# EAGLE schematic untitled (EAGLE 6.1)

## Sheet 1 of 4
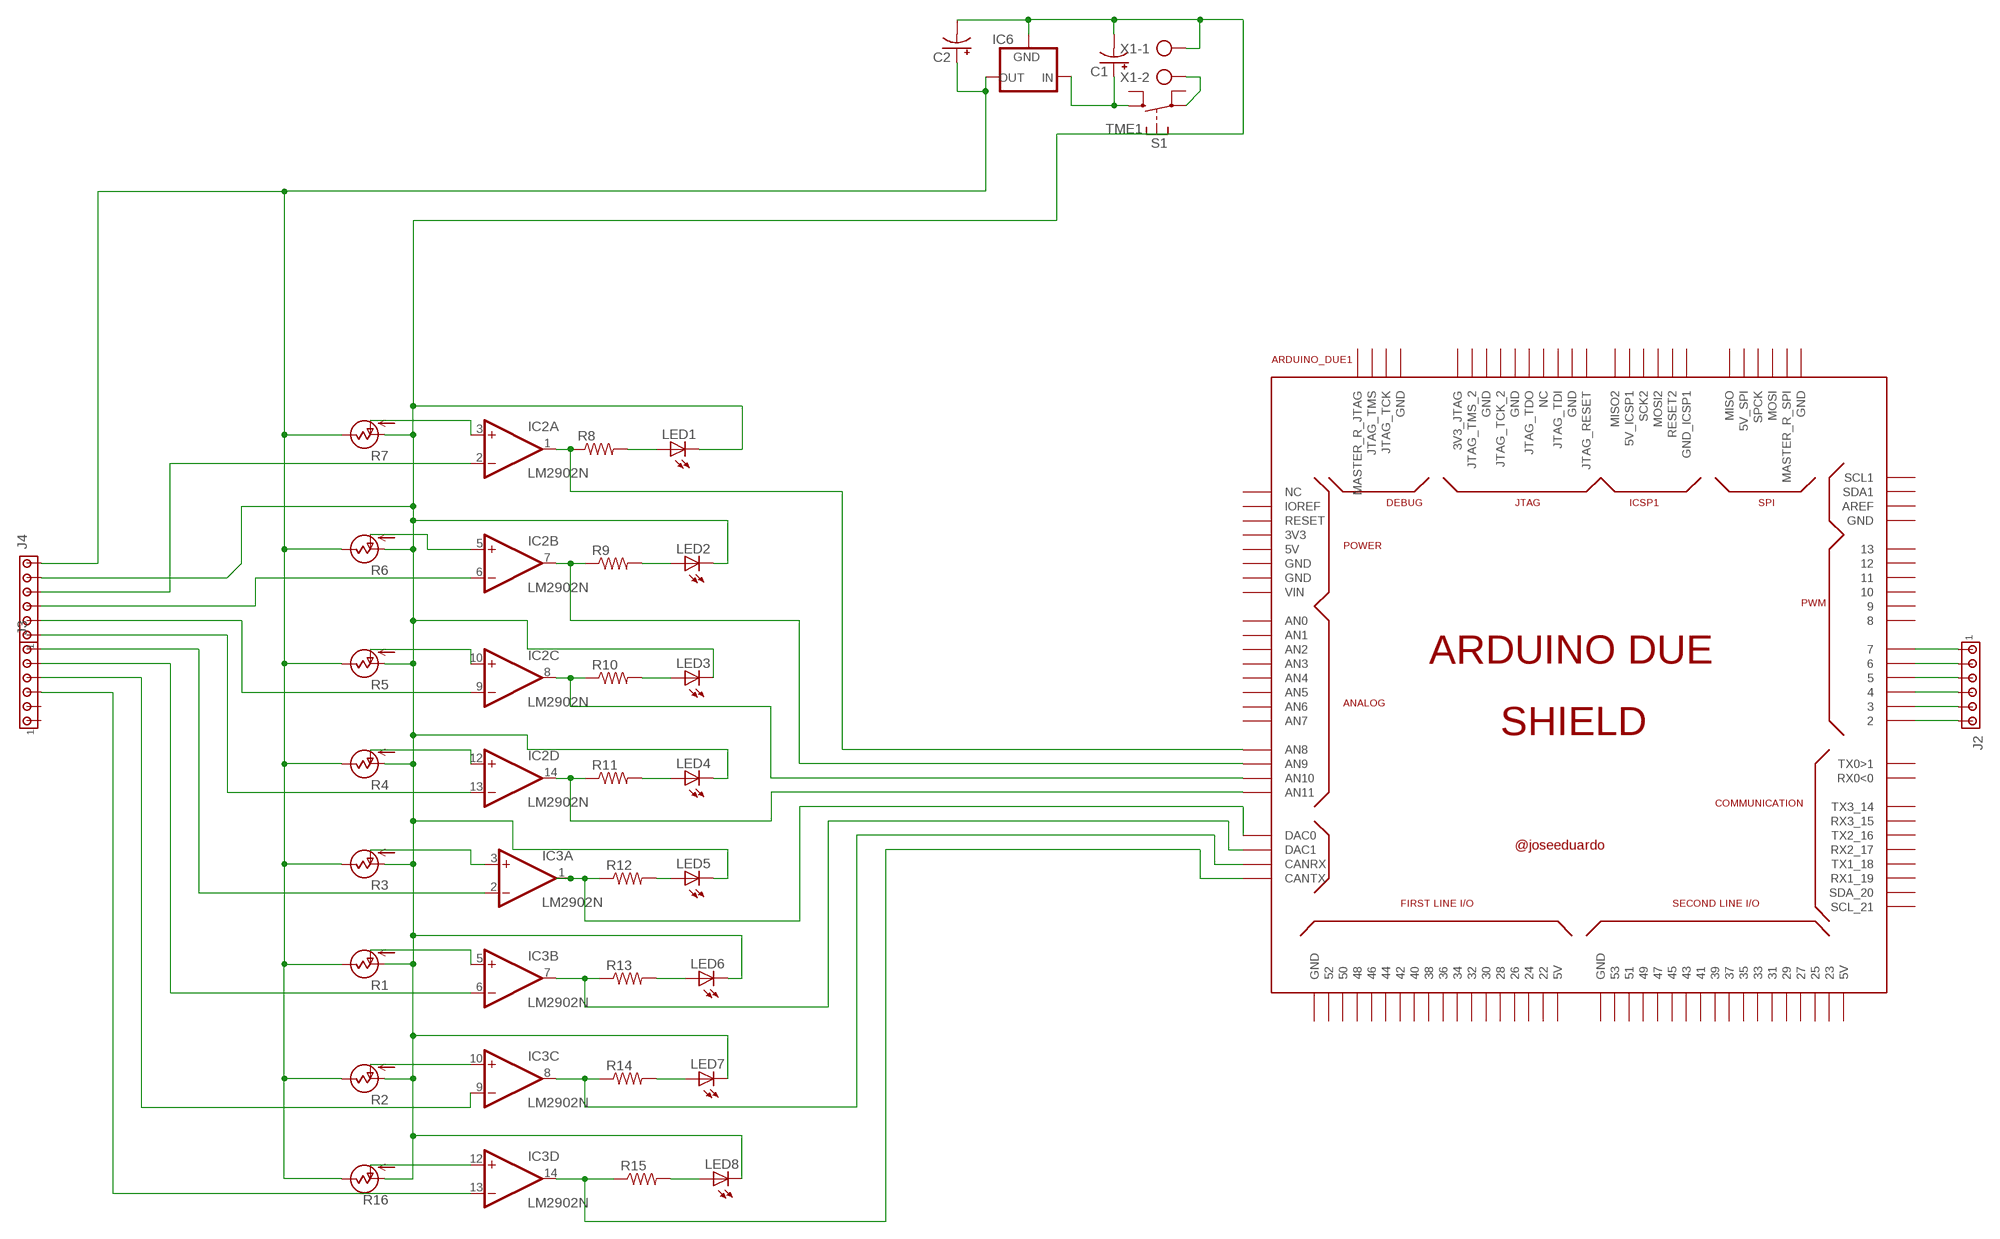
[diagram p0: schematic, sheet 1]

### Parts
ARDUINO_DUE1  ARDUINO_DUE_SHIELD  [ARDUINO_DUE_SHIELD]
C1  CPOL-USE5-10.5  [E5-10,5]
C2  CPOL-USE5-10.5  [E5-10,5]
IC2  LM2902N  [DIL14]
IC3  LM2902N  [DIL14]
IC6  V_REG_78XXSIDE  [78XXL]
J2  MTA06-156  [1X6MTA]
J3  MTA06-156  [1X6MTA]
J4  MTA06-156  [1X6MTA]
LED1  LED3MM  [LED3MM]
LED2  LED3MM  [LED3MM]
LED3  LED3MM  [LED3MM]
LED4  LED3MM  [LED3MM]
LED5  LED3MM  [LED3MM]
LED6  LED3MM  [LED3MM]
LED7  LED3MM  [LED3MM]
LED8  LED3MM  [LED3MM]
R1  POTTRS63P  [S63P]
R2  POTTRS63P  [S63P]
R3  POTTRS63P  [S63P]
R4  POTTRS63P  [S63P]
R5  POTTRS63P  [S63P]
R6  POTTRS63P  [S63P]
R7  POTTRS63P  [S63P]
R8  R-US_0207/10  [0207/10]
R9  R-US_0207/10  [0207/10]
R10  R-US_0207/10  [0207/10]
R11  R-US_0207/10  [0207/10]
R12  R-US_0207/10  [0207/10]
R13  R-US_0207/10  [0207/10]
R14  R-US_0207/10  [0207/10]
R15  R-US_0207/10  [0207/10]
R16  POTTRS63P  [S63P]
S1  TME1  [TME1]
X1  AK300/2  [AK300/2]

### Nets
N$1: ARDUINO_DUE1.7 J2.1
N$2: IC2.2(A:-IN) J4.4
N$3: ARDUINO_DUE1.6 J2.2
N$4: IC2.6(B:-IN) J4.3
N$5: IC2.5(B:+IN) R6.S(OUT)
N$6: IC2.3(A:+IN) R7.S(OUT)
N$7: IC2.10(C:+IN) R5.S(OUT)
N$8: IC2.12(D:+IN) R4.S(OUT)
N$9: IC3.3(A:+IN) R3.S(OUT)
N$10: IC3.5(B:+IN) R1.S(OUT)
N$11: IC3.10(C:+IN) R2.S(OUT)
N$12: IC3.12(D:+IN) R16.S(OUT)
N$13: ARDUINO_DUE1.A8(AN8) IC2.1(A:OUT) R8.1
N$14: LED1.A R8.2
N$15: ARDUINO_DUE1.A9(AN9) IC2.7(B:OUT) R9.1
N$16: LED2.A R9.2
N$17: ARDUINO_DUE1.A10(AN10) IC2.8(C:OUT) R10.1
N$18: LED3.A R10.2
N$19: ARDUINO_DUE1.A11(AN11) IC2.14(D:OUT) R11.1
N$20: ARDUINO_DUE1.DAC0 IC3.1(A:OUT) R12.1
N$21: ARDUINO_DUE1.DAC1 IC3.7(B:OUT) R13.1
N$22: ARDUINO_DUE1.CANRX IC3.8(C:OUT) R14.1
N$23: LED4.A R11.2
N$24: LED5.A R12.2
N$25: LED6.A R13.2
N$26: LED7.A R14.2
N$27: ARDUINO_DUE1.CANTX IC3.14(D:OUT) R15.1
N$28: LED8.A R15.2
N$29: IC2.9(C:-IN) J4.2
N$30: ARDUINO_DUE1.5 J2.3
N$31: IC2.13(D:-IN) J4.1
N$32: IC3.2(A:-IN) J3.6
N$33: IC3.6(B:-IN) J3.5
N$34: IC3.9(C:-IN) J3.4
N$35: ARDUINO_DUE1.4 J2.4
N$36: ARDUINO_DUE1.3 J2.5
N$37: ARDUINO_DUE1.2 J2.6
N$38: IC3.13(D:-IN) J3.3
N$39: S1.2(P) X1.2
N$41: C2.+ IC6.OUT J4.6 R1.E(VSS) R2.E(VSS) R3.E(VSS) R4.E(VSS) R5.E(VSS) R6.E(VSS) R7.E(VSS) R16.E(VSS)
N$55: C1.- C2.- IC6.GND J4.5 LED1.K(C) LED2.K(C) LED3.K(C) LED4.K(C) LED5.K(C) LED6.K(C) LED7.K(C) LED8.K(C) R1.A(VDD) R2.A(VDD) R3.A(VDD) R4.A(VDD) R5.A(VDD) R6.A(VDD) R7.A(VDD) R16.A(VDD) X1.1
N$63: C1.+ IC6.IN S1.1(S)
Unconnected: ARDUINO_DUE1.0(RX0<0) ARDUINO_DUE1.1(TX0>1) ARDUINO_DUE1.3V3 ARDUINO_DUE1.3V3_JTAG ARDUINO_DUE1.5V0(5V) ARDUINO_DUE1.5V0_1(5V) ARDUINO_DUE1.5V0_2(5V) ARDUINO_DUE1.5V_2(5V_SPI) ARDUINO_DUE1.5V_ICSP1 ARDUINO_DUE1.8 ARDUINO_DUE1.9 ARDUINO_DUE1.10 ARDUINO_DUE1.11 ARDUINO_DUE1.12 ARDUINO_DUE1.13 ARDUINO_DUE1.14(TX3_14) ARDUINO_DUE1.15(RX3_15) ARDUINO_DUE1.16(TX2_16) ARDUINO_DUE1.17(RX2_17) ARDUINO_DUE1.18(TX1_18) ARDUINO_DUE1.19(RX1_19) ARDUINO_DUE1.20(SDA_20) ARDUINO_DUE1.21(SCL_21) ARDUINO_DUE1.22 ARDUINO_DUE1.23 ARDUINO_DUE1.24 ARDUINO_DUE1.25 ARDUINO_DUE1.26 ARDUINO_DUE1.27 ARDUINO_DUE1.28 ARDUINO_DUE1.29 ARDUINO_DUE1.30 ARDUINO_DUE1.31 ARDUINO_DUE1.32 ARDUINO_DUE1.33 ARDUINO_DUE1.34 ARDUINO_DUE1.35 ARDUINO_DUE1.36 ARDUINO_DUE1.37 ARDUINO_DUE1.38 ARDUINO_DUE1.39 ARDUINO_DUE1.40 ARDUINO_DUE1.41 ARDUINO_DUE1.42 ARDUINO_DUE1.43 ARDUINO_DUE1.44 ARDUINO_DUE1.45 ARDUINO_DUE1.46 ARDUINO_DUE1.47 ARDUINO_DUE1.48 ARDUINO_DUE1.49 ARDUINO_DUE1.50 ARDUINO_DUE1.51 ARDUINO_DUE1.52 ARDUINO_DUE1.53 ARDUINO_DUE1.A0(AN0) ARDUINO_DUE1.A1(AN1) ARDUINO_DUE1.A2(AN2) ARDUINO_DUE1.A3(AN3) ARDUINO_DUE1.A4(AN4) ARDUINO_DUE1.A5(AN5) ARDUINO_DUE1.A6(AN6) ARDUINO_DUE1.A7(AN7) ARDUINO_DUE1.AREF ARDUINO_DUE1.GND ARDUINO_DUE1.GND_1(GND) ARDUINO_DUE1.GND_2(GND) ARDUINO_DUE1.GND_3(GND) ARDUINO_DUE1.GND_4(GND) ARDUINO_DUE1.GND_5(GND) ARDUINO_DUE1.GND_7(GND) ARDUINO_DUE1.GND_8(GND) ARDUINO_DUE1.GND_9(GND) ARDUINO_DUE1.GND_10(GND) ARDUINO_DUE1.GND_ICSP1 ARDUINO_DUE1.IOREF ARDUINO_DUE1.JTAG_RESET ARDUINO_DUE1.JTAG_TCK ARDUINO_DUE1.JTAG_TCK_2 ARDUINO_DUE1.JTAG_TDI ARDUINO_DUE1.JTAG_TDO ARDUINO_DUE1.JTAG_TMS ARDUINO_DUE1.JTAG_TMS_2 ARDUINO_DUE1.MASTER_RESET_JTAG(MASTER_R_JTAG) ARDUINO_DUE1.MASTER_RESET_SPI(MASTER_R_SPI) ARDUINO_DUE1.MISO ARDUINO_DUE1.MISO2 ARDUINO_DUE1.MOSI ARDUINO_DUE1.MOSI2 ARDUINO_DUE1.NC_2(NC) ARDUINO_DUE1.NC_5(NC) ARDUINO_DUE1.RESET ARDUINO_DUE1.RESET2 ARDUINO_DUE1.SCK2 ARDUINO_DUE1.SCL1 ARDUINO_DUE1.SDA1 ARDUINO_DUE1.SPCK ARDUINO_DUE1.VIN J3.1 J3.2 S1.4(P) S1.5(S)

## Sheet 2 of 4
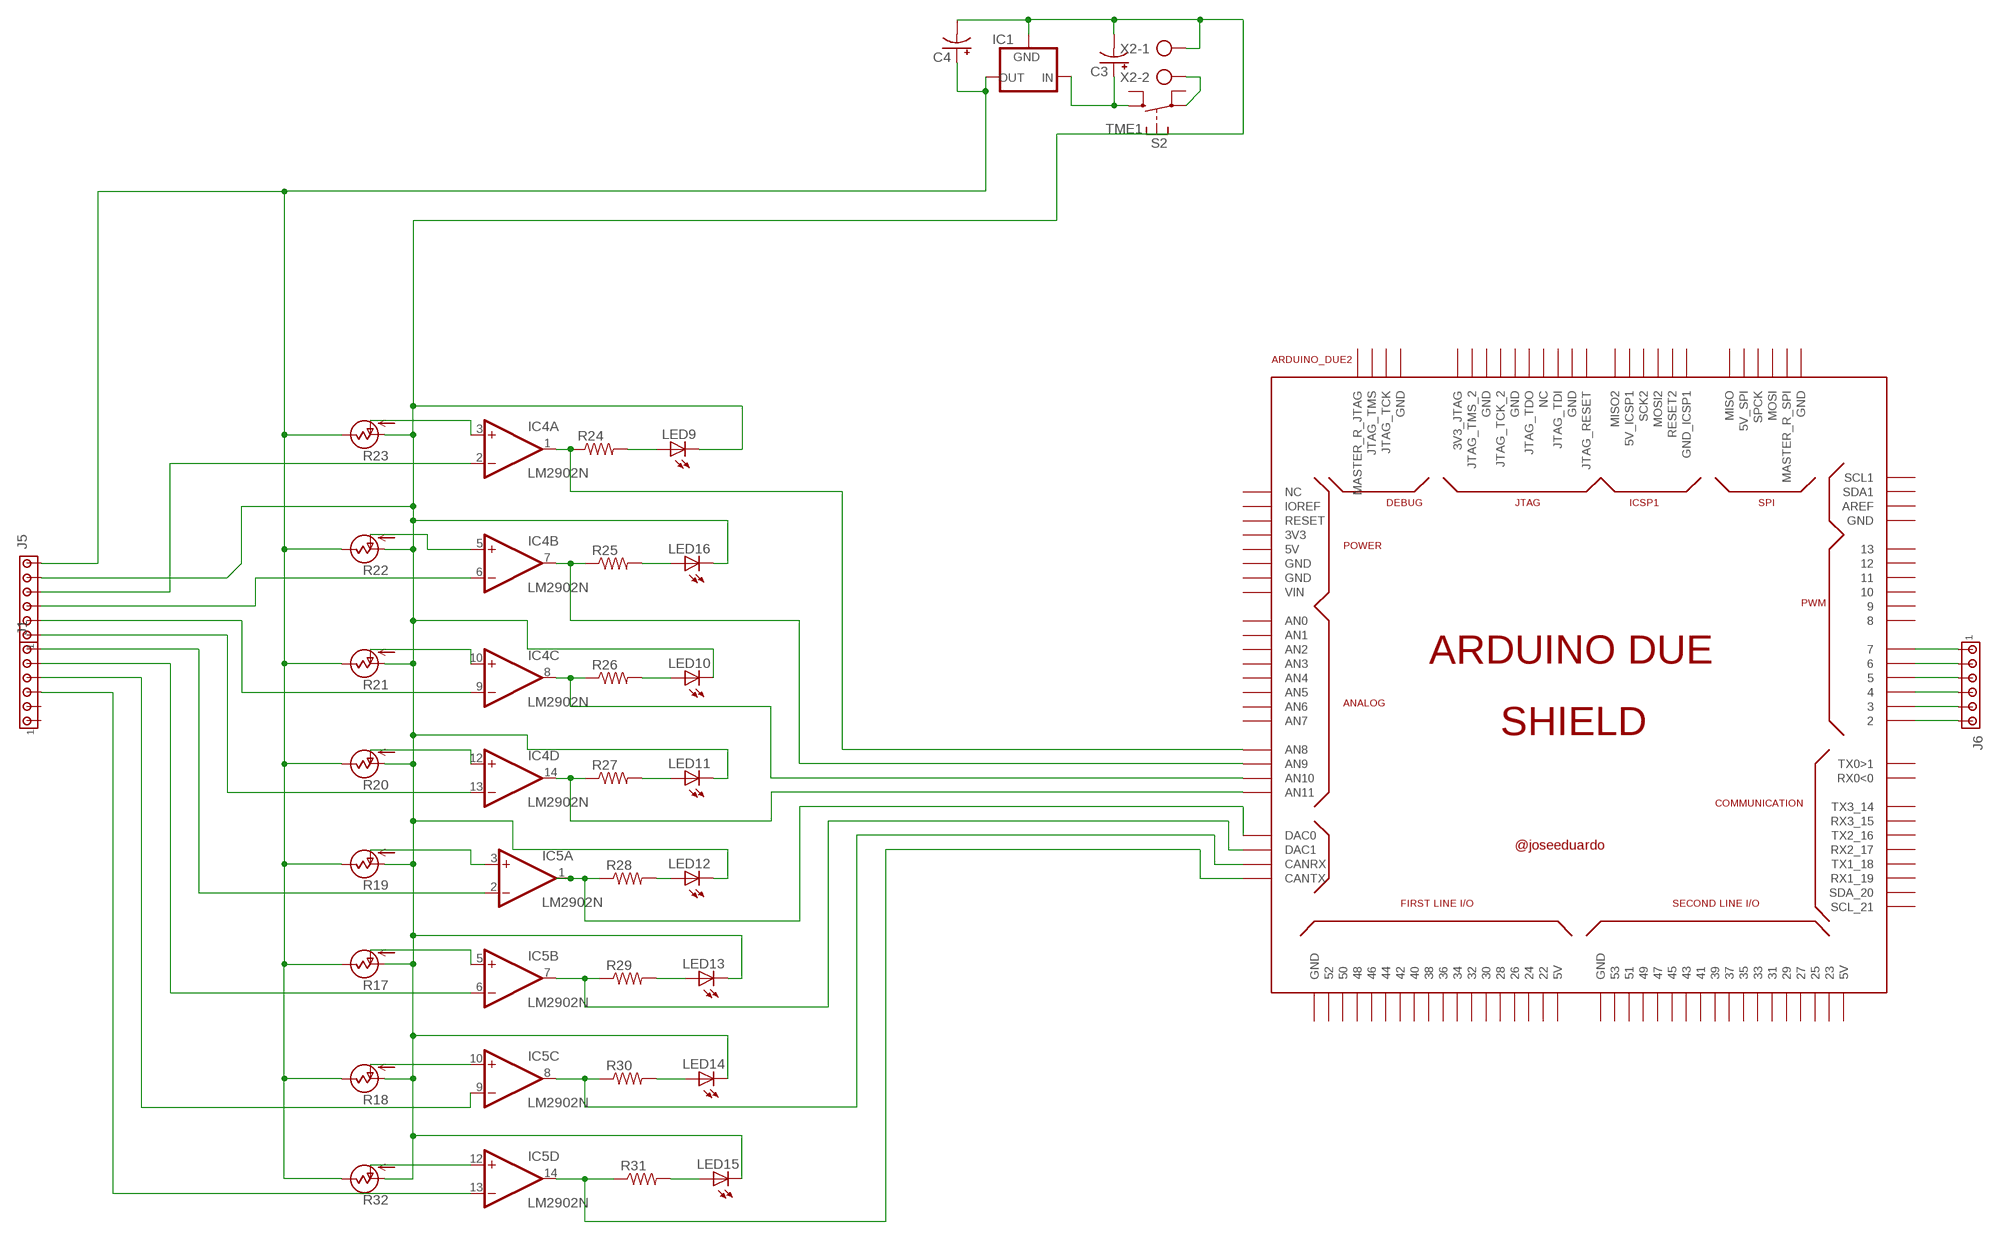
[diagram p1: schematic, sheet 2]

### Parts
ARDUINO_DUE2  ARDUINO_DUE_SHIELD  [ARDUINO_DUE_SHIELD]
C3  CPOL-USE5-10.5  [E5-10,5]
C4  CPOL-USE5-10.5  [E5-10,5]
IC1  V_REG_78XXSIDE  [78XXL]
IC4  LM2902N  [DIL14]
IC5  LM2902N  [DIL14]
J1  MTA06-156  [1X6MTA]
J5  MTA06-156  [1X6MTA]
J6  MTA06-156  [1X6MTA]
LED9  LED3MM  [LED3MM]
LED10  LED3MM  [LED3MM]
LED11  LED3MM  [LED3MM]
LED12  LED3MM  [LED3MM]
LED13  LED3MM  [LED3MM]
LED14  LED3MM  [LED3MM]
LED15  LED3MM  [LED3MM]
LED16  LED3MM  [LED3MM]
R17  POTTRS63P  [S63P]
R18  POTTRS63P  [S63P]
R19  POTTRS63P  [S63P]
R20  POTTRS63P  [S63P]
R21  POTTRS63P  [S63P]
R22  POTTRS63P  [S63P]
R23  POTTRS63P  [S63P]
R24  R-US_0207/10  [0207/10]
R25  R-US_0207/10  [0207/10]
R26  R-US_0207/10  [0207/10]
R27  R-US_0207/10  [0207/10]
R28  R-US_0207/10  [0207/10]
R29  R-US_0207/10  [0207/10]
R30  R-US_0207/10  [0207/10]
R31  R-US_0207/10  [0207/10]
R32  POTTRS63P  [S63P]
S2  TME1  [TME1]
X2  AK300/2  [AK300/2]

### Nets
N$60: IC4.5(B:+IN) R22.S(OUT)
N$61: IC4.3(A:+IN) R23.S(OUT)
N$62: IC4.10(C:+IN) R21.S(OUT)
N$64: IC4.12(D:+IN) R20.S(OUT)
N$65: IC5.3(A:+IN) R19.S(OUT)
N$66: IC5.5(B:+IN) R17.S(OUT)
N$67: IC5.10(C:+IN) R18.S(OUT)
N$68: IC5.12(D:+IN) R32.S(OUT)
N$69: ARDUINO_DUE2.A8(AN8) IC4.1(A:OUT) R24.1
N$70: ARDUINO_DUE2.A9(AN9) IC4.7(B:OUT) R25.1
N$71: ARDUINO_DUE2.A10(AN10) IC4.8(C:OUT) R26.1
N$72: LED10.A R26.2
N$73: ARDUINO_DUE2.A11(AN11) IC4.14(D:OUT) R27.1
N$74: ARDUINO_DUE2.DAC0 IC5.1(A:OUT) R28.1
N$75: ARDUINO_DUE2.DAC1 IC5.7(B:OUT) R29.1
N$76: ARDUINO_DUE2.CANRX IC5.8(C:OUT) R30.1
N$77: LED11.A R27.2
N$78: LED12.A R28.2
N$79: LED13.A R29.2
N$80: LED14.A R30.2
N$81: ARDUINO_DUE2.CANTX IC5.14(D:OUT) R31.1
N$82: LED15.A R31.2
N$83: LED9.A R24.2
N$84: LED16.A R25.2
N$85: IC4.2(A:-IN) J5.4
N$86: IC4.6(B:-IN) J5.3
N$87: IC4.9(C:-IN) J5.2
N$88: IC4.13(D:-IN) J5.1
N$89: IC5.2(A:-IN) J1.6
N$90: IC5.6(B:-IN) J1.5
N$91: IC5.9(C:-IN) J1.4
N$92: IC5.13(D:-IN) J1.3
N$93: C4.+ IC1.OUT J5.6 R17.E(VSS) R18.E(VSS) R19.E(VSS) R20.E(VSS) R21.E(VSS) R22.E(VSS) R23.E(VSS) R32.E(VSS)
N$94: C3.- C4.- IC1.GND J5.5 LED9.K(C) LED10.K(C) LED11.K(C) LED12.K(C) LED13.K(C) LED14.K(C) LED15.K(C) LED16.K(C) R17.A(VDD) R18.A(VDD) R19.A(VDD) R20.A(VDD) R21.A(VDD) R22.A(VDD) R23.A(VDD) R32.A(VDD) X2.1
N$95: C3.+ IC1.IN S2.1(S)
N$96: ARDUINO_DUE2.7 J6.1
N$97: ARDUINO_DUE2.6 J6.2
N$98: ARDUINO_DUE2.5 J6.3
N$99: ARDUINO_DUE2.4 J6.4
N$100: ARDUINO_DUE2.3 J6.5
N$101: ARDUINO_DUE2.2 J6.6
N$102: S2.2(P) X2.2
Unconnected: ARDUINO_DUE2.0(RX0<0) ARDUINO_DUE2.1(TX0>1) ARDUINO_DUE2.3V3 ARDUINO_DUE2.3V3_JTAG ARDUINO_DUE2.5V0(5V) ARDUINO_DUE2.5V0_1(5V) ARDUINO_DUE2.5V0_2(5V) ARDUINO_DUE2.5V_2(5V_SPI) ARDUINO_DUE2.5V_ICSP1 ARDUINO_DUE2.8 ARDUINO_DUE2.9 ARDUINO_DUE2.10 ARDUINO_DUE2.11 ARDUINO_DUE2.12 ARDUINO_DUE2.13 ARDUINO_DUE2.14(TX3_14) ARDUINO_DUE2.15(RX3_15) ARDUINO_DUE2.16(TX2_16) ARDUINO_DUE2.17(RX2_17) ARDUINO_DUE2.18(TX1_18) ARDUINO_DUE2.19(RX1_19) ARDUINO_DUE2.20(SDA_20) ARDUINO_DUE2.21(SCL_21) ARDUINO_DUE2.22 ARDUINO_DUE2.23 ARDUINO_DUE2.24 ARDUINO_DUE2.25 ARDUINO_DUE2.26 ARDUINO_DUE2.27 ARDUINO_DUE2.28 ARDUINO_DUE2.29 ARDUINO_DUE2.30 ARDUINO_DUE2.31 ARDUINO_DUE2.32 ARDUINO_DUE2.33 ARDUINO_DUE2.34 ARDUINO_DUE2.35 ARDUINO_DUE2.36 ARDUINO_DUE2.37 ARDUINO_DUE2.38 ARDUINO_DUE2.39 ARDUINO_DUE2.40 ARDUINO_DUE2.41 ARDUINO_DUE2.42 ARDUINO_DUE2.43 ARDUINO_DUE2.44 ARDUINO_DUE2.45 ARDUINO_DUE2.46 ARDUINO_DUE2.47 ARDUINO_DUE2.48 ARDUINO_DUE2.49 ARDUINO_DUE2.50 ARDUINO_DUE2.51 ARDUINO_DUE2.52 ARDUINO_DUE2.53 ARDUINO_DUE2.A0(AN0) ARDUINO_DUE2.A1(AN1) ARDUINO_DUE2.A2(AN2) ARDUINO_DUE2.A3(AN3) ARDUINO_DUE2.A4(AN4) ARDUINO_DUE2.A5(AN5) ARDUINO_DUE2.A6(AN6) ARDUINO_DUE2.A7(AN7) ARDUINO_DUE2.AREF ARDUINO_DUE2.GND ARDUINO_DUE2.GND_1(GND) ARDUINO_DUE2.GND_2(GND) ARDUINO_DUE2.GND_3(GND) ARDUINO_DUE2.GND_4(GND) ARDUINO_DUE2.GND_5(GND) ARDUINO_DUE2.GND_7(GND) ARDUINO_DUE2.GND_8(GND) ARDUINO_DUE2.GND_9(GND) ARDUINO_DUE2.GND_10(GND) ARDUINO_DUE2.GND_ICSP1 ARDUINO_DUE2.IOREF ARDUINO_DUE2.JTAG_RESET ARDUINO_DUE2.JTAG_TCK ARDUINO_DUE2.JTAG_TCK_2 ARDUINO_DUE2.JTAG_TDI ARDUINO_DUE2.JTAG_TDO ARDUINO_DUE2.JTAG_TMS ARDUINO_DUE2.JTAG_TMS_2 ARDUINO_DUE2.MASTER_RESET_JTAG(MASTER_R_JTAG) ARDUINO_DUE2.MASTER_RESET_SPI(MASTER_R_SPI) ARDUINO_DUE2.MISO ARDUINO_DUE2.MISO2 ARDUINO_DUE2.MOSI ARDUINO_DUE2.MOSI2 ARDUINO_DUE2.NC_2(NC) ARDUINO_DUE2.NC_5(NC) ARDUINO_DUE2.RESET ARDUINO_DUE2.RESET2 ARDUINO_DUE2.SCK2 ARDUINO_DUE2.SCL1 ARDUINO_DUE2.SDA1 ARDUINO_DUE2.SPCK ARDUINO_DUE2.VIN J1.1 J1.2 S2.4(P) S2.5(S)

## Sheet 3 of 4
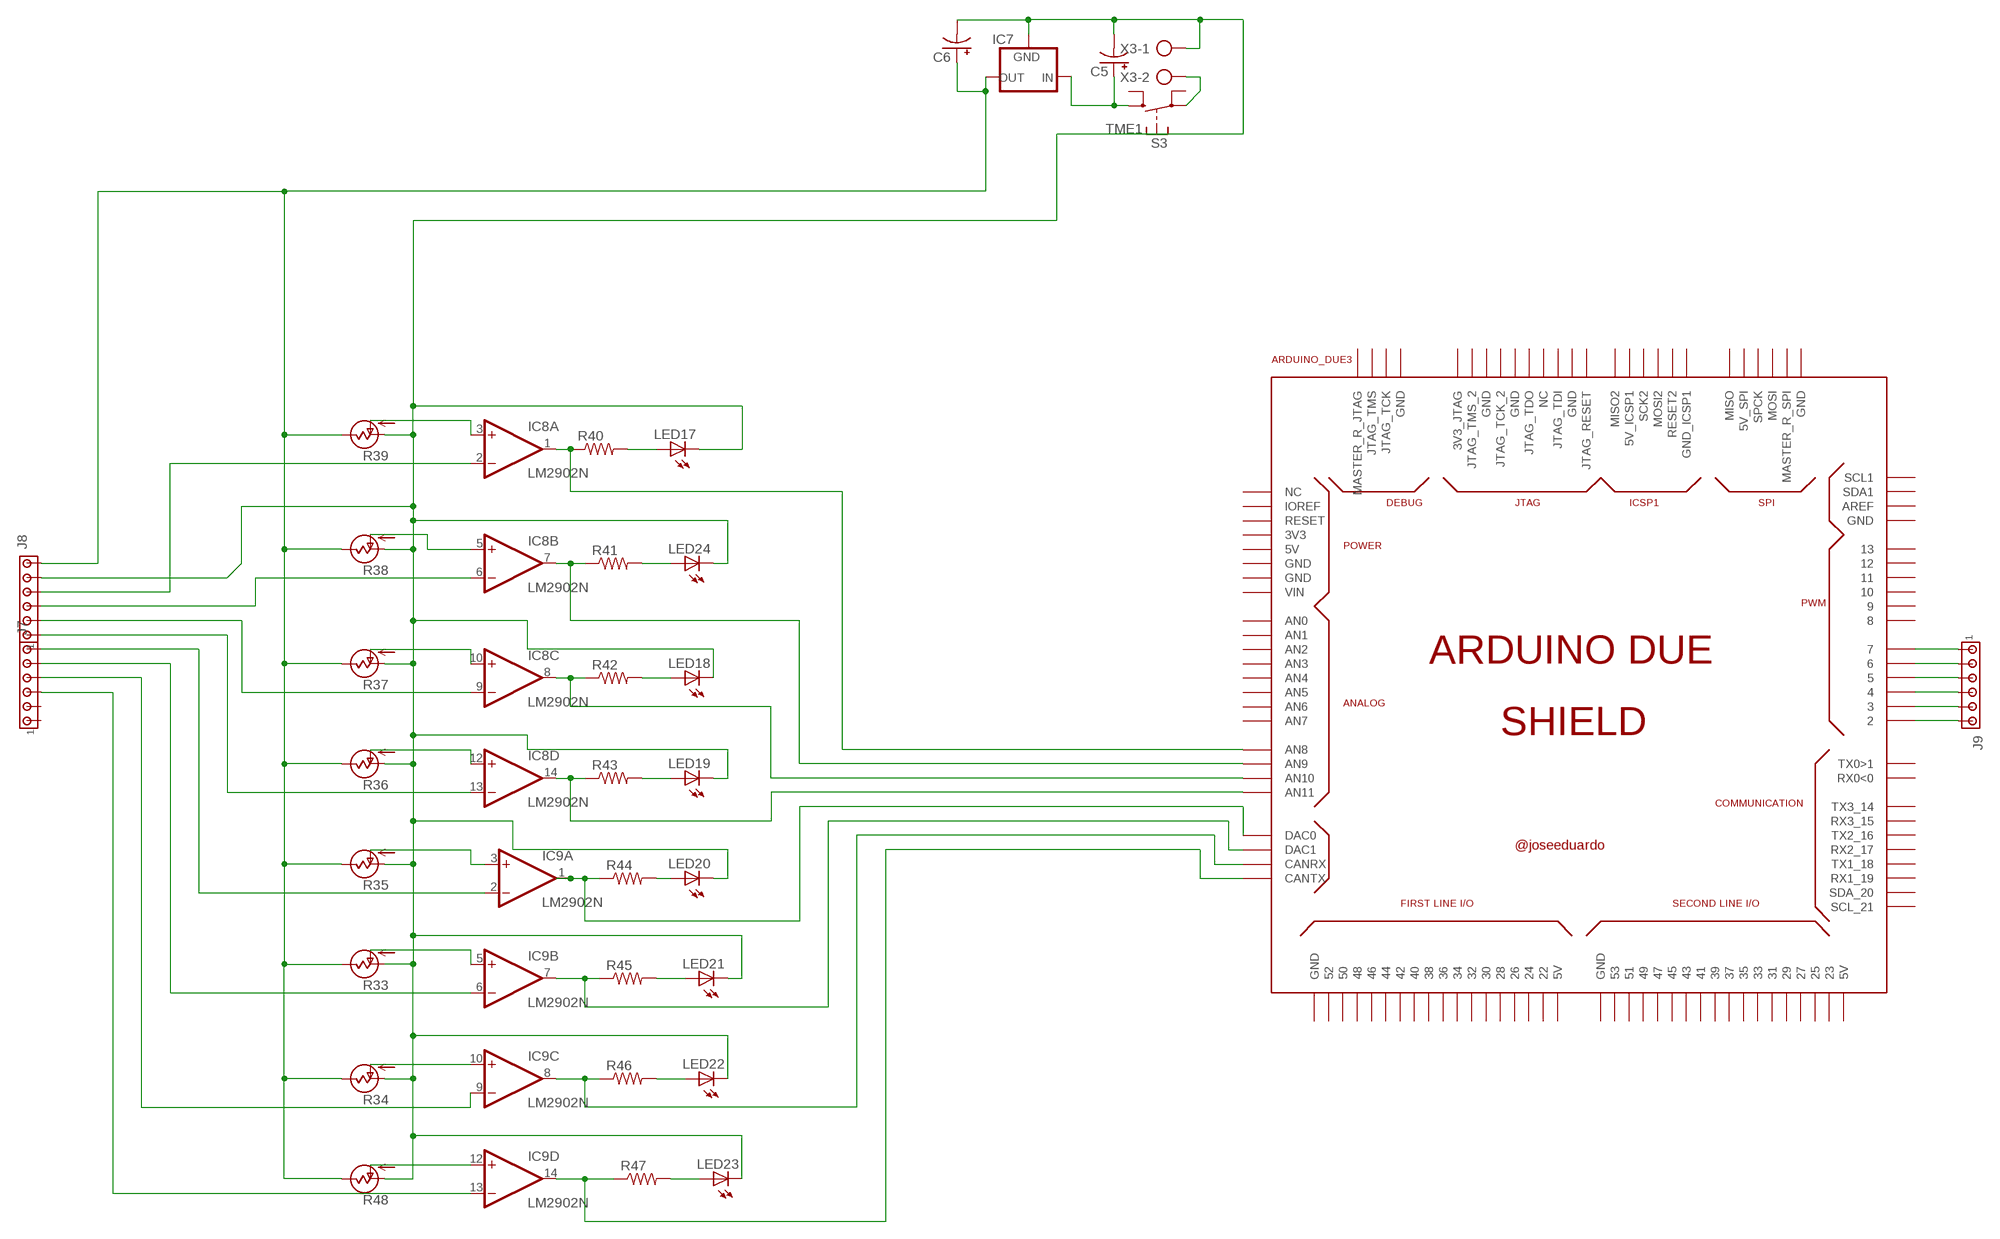
[diagram p2: schematic, sheet 3]

### Parts
ARDUINO_DUE3  ARDUINO_DUE_SHIELD  [ARDUINO_DUE_SHIELD]
C5  CPOL-USE5-10.5  [E5-10,5]
C6  CPOL-USE5-10.5  [E5-10,5]
IC7  V_REG_78XXSIDE  [78XXL]
IC8  LM2902N  [DIL14]
IC9  LM2902N  [DIL14]
J7  MTA06-156  [1X6MTA]
J8  MTA06-156  [1X6MTA]
J9  MTA06-156  [1X6MTA]
LED17  LED3MM  [LED3MM]
LED18  LED3MM  [LED3MM]
LED19  LED3MM  [LED3MM]
LED20  LED3MM  [LED3MM]
LED21  LED3MM  [LED3MM]
LED22  LED3MM  [LED3MM]
LED23  LED3MM  [LED3MM]
LED24  LED3MM  [LED3MM]
R33  POTTRS63P  [S63P]
R34  POTTRS63P  [S63P]
R35  POTTRS63P  [S63P]
R36  POTTRS63P  [S63P]
R37  POTTRS63P  [S63P]
R38  POTTRS63P  [S63P]
R39  POTTRS63P  [S63P]
R40  R-US_0207/10  [0207/10]
R41  R-US_0207/10  [0207/10]
R42  R-US_0207/10  [0207/10]
R43  R-US_0207/10  [0207/10]
R44  R-US_0207/10  [0207/10]
R45  R-US_0207/10  [0207/10]
R46  R-US_0207/10  [0207/10]
R47  R-US_0207/10  [0207/10]
R48  POTTRS63P  [S63P]
S3  TME1  [TME1]
X3  AK300/2  [AK300/2]

### Nets
N$121: IC8.5(B:+IN) R38.S(OUT)
N$122: IC8.3(A:+IN) R39.S(OUT)
N$123: IC8.10(C:+IN) R37.S(OUT)
N$124: IC8.12(D:+IN) R36.S(OUT)
N$125: IC9.3(A:+IN) R35.S(OUT)
N$126: IC9.5(B:+IN) R33.S(OUT)
N$127: IC9.10(C:+IN) R34.S(OUT)
N$128: IC9.12(D:+IN) R48.S(OUT)
N$129: ARDUINO_DUE3.A8(AN8) IC8.1(A:OUT) R40.1
N$130: ARDUINO_DUE3.A9(AN9) IC8.7(B:OUT) R41.1
N$131: ARDUINO_DUE3.A10(AN10) IC8.8(C:OUT) R42.1
N$132: LED18.A R42.2
N$133: ARDUINO_DUE3.A11(AN11) IC8.14(D:OUT) R43.1
N$134: ARDUINO_DUE3.DAC0 IC9.1(A:OUT) R44.1
N$135: ARDUINO_DUE3.DAC1 IC9.7(B:OUT) R45.1
N$136: ARDUINO_DUE3.CANRX IC9.8(C:OUT) R46.1
N$137: LED19.A R43.2
N$138: LED20.A R44.2
N$139: LED21.A R45.2
N$140: LED22.A R46.2
N$141: ARDUINO_DUE3.CANTX IC9.14(D:OUT) R47.1
N$142: LED23.A R47.2
N$143: LED17.A R40.2
N$144: LED24.A R41.2
N$145: IC8.2(A:-IN) J8.4
N$146: IC8.6(B:-IN) J8.3
N$147: IC8.9(C:-IN) J8.2
N$148: IC8.13(D:-IN) J8.1
N$149: IC9.2(A:-IN) J7.6
N$150: IC9.6(B:-IN) J7.5
N$151: IC9.9(C:-IN) J7.4
N$152: IC9.13(D:-IN) J7.3
N$153: C6.+ IC7.OUT J8.6 R33.E(VSS) R34.E(VSS) R35.E(VSS) R36.E(VSS) R37.E(VSS) R38.E(VSS) R39.E(VSS) R48.E(VSS)
N$154: C5.- C6.- IC7.GND J8.5 LED17.K(C) LED18.K(C) LED19.K(C) LED20.K(C) LED21.K(C) LED22.K(C) LED23.K(C) LED24.K(C) R33.A(VDD) R34.A(VDD) R35.A(VDD) R36.A(VDD) R37.A(VDD) R38.A(VDD) R39.A(VDD) R48.A(VDD) X3.1
N$155: C5.+ IC7.IN S3.1(S)
N$156: ARDUINO_DUE3.7 J9.1
N$157: ARDUINO_DUE3.6 J9.2
N$158: ARDUINO_DUE3.5 J9.3
N$159: ARDUINO_DUE3.4 J9.4
N$160: ARDUINO_DUE3.3 J9.5
N$161: ARDUINO_DUE3.2 J9.6
N$162: S3.2(P) X3.2
Unconnected: ARDUINO_DUE3.0(RX0<0) ARDUINO_DUE3.1(TX0>1) ARDUINO_DUE3.3V3 ARDUINO_DUE3.3V3_JTAG ARDUINO_DUE3.5V0(5V) ARDUINO_DUE3.5V0_1(5V) ARDUINO_DUE3.5V0_2(5V) ARDUINO_DUE3.5V_2(5V_SPI) ARDUINO_DUE3.5V_ICSP1 ARDUINO_DUE3.8 ARDUINO_DUE3.9 ARDUINO_DUE3.10 ARDUINO_DUE3.11 ARDUINO_DUE3.12 ARDUINO_DUE3.13 ARDUINO_DUE3.14(TX3_14) ARDUINO_DUE3.15(RX3_15) ARDUINO_DUE3.16(TX2_16) ARDUINO_DUE3.17(RX2_17) ARDUINO_DUE3.18(TX1_18) ARDUINO_DUE3.19(RX1_19) ARDUINO_DUE3.20(SDA_20) ARDUINO_DUE3.21(SCL_21) ARDUINO_DUE3.22 ARDUINO_DUE3.23 ARDUINO_DUE3.24 ARDUINO_DUE3.25 ARDUINO_DUE3.26 ARDUINO_DUE3.27 ARDUINO_DUE3.28 ARDUINO_DUE3.29 ARDUINO_DUE3.30 ARDUINO_DUE3.31 ARDUINO_DUE3.32 ARDUINO_DUE3.33 ARDUINO_DUE3.34 ARDUINO_DUE3.35 ARDUINO_DUE3.36 ARDUINO_DUE3.37 ARDUINO_DUE3.38 ARDUINO_DUE3.39 ARDUINO_DUE3.40 ARDUINO_DUE3.41 ARDUINO_DUE3.42 ARDUINO_DUE3.43 ARDUINO_DUE3.44 ARDUINO_DUE3.45 ARDUINO_DUE3.46 ARDUINO_DUE3.47 ARDUINO_DUE3.48 ARDUINO_DUE3.49 ARDUINO_DUE3.50 ARDUINO_DUE3.51 ARDUINO_DUE3.52 ARDUINO_DUE3.53 ARDUINO_DUE3.A0(AN0) ARDUINO_DUE3.A1(AN1) ARDUINO_DUE3.A2(AN2) ARDUINO_DUE3.A3(AN3) ARDUINO_DUE3.A4(AN4) ARDUINO_DUE3.A5(AN5) ARDUINO_DUE3.A6(AN6) ARDUINO_DUE3.A7(AN7) ARDUINO_DUE3.AREF ARDUINO_DUE3.GND ARDUINO_DUE3.GND_1(GND) ARDUINO_DUE3.GND_2(GND) ARDUINO_DUE3.GND_3(GND) ARDUINO_DUE3.GND_4(GND) ARDUINO_DUE3.GND_5(GND) ARDUINO_DUE3.GND_7(GND) ARDUINO_DUE3.GND_8(GND) ARDUINO_DUE3.GND_9(GND) ARDUINO_DUE3.GND_10(GND) ARDUINO_DUE3.GND_ICSP1 ARDUINO_DUE3.IOREF ARDUINO_DUE3.JTAG_RESET ARDUINO_DUE3.JTAG_TCK ARDUINO_DUE3.JTAG_TCK_2 ARDUINO_DUE3.JTAG_TDI ARDUINO_DUE3.JTAG_TDO ARDUINO_DUE3.JTAG_TMS ARDUINO_DUE3.JTAG_TMS_2 ARDUINO_DUE3.MASTER_RESET_JTAG(MASTER_R_JTAG) ARDUINO_DUE3.MASTER_RESET_SPI(MASTER_R_SPI) ARDUINO_DUE3.MISO ARDUINO_DUE3.MISO2 ARDUINO_DUE3.MOSI ARDUINO_DUE3.MOSI2 ARDUINO_DUE3.NC_2(NC) ARDUINO_DUE3.NC_5(NC) ARDUINO_DUE3.RESET ARDUINO_DUE3.RESET2 ARDUINO_DUE3.SCK2 ARDUINO_DUE3.SCL1 ARDUINO_DUE3.SDA1 ARDUINO_DUE3.SPCK ARDUINO_DUE3.VIN J7.1 J7.2 S3.4(P) S3.5(S)

## Sheet 4 of 4
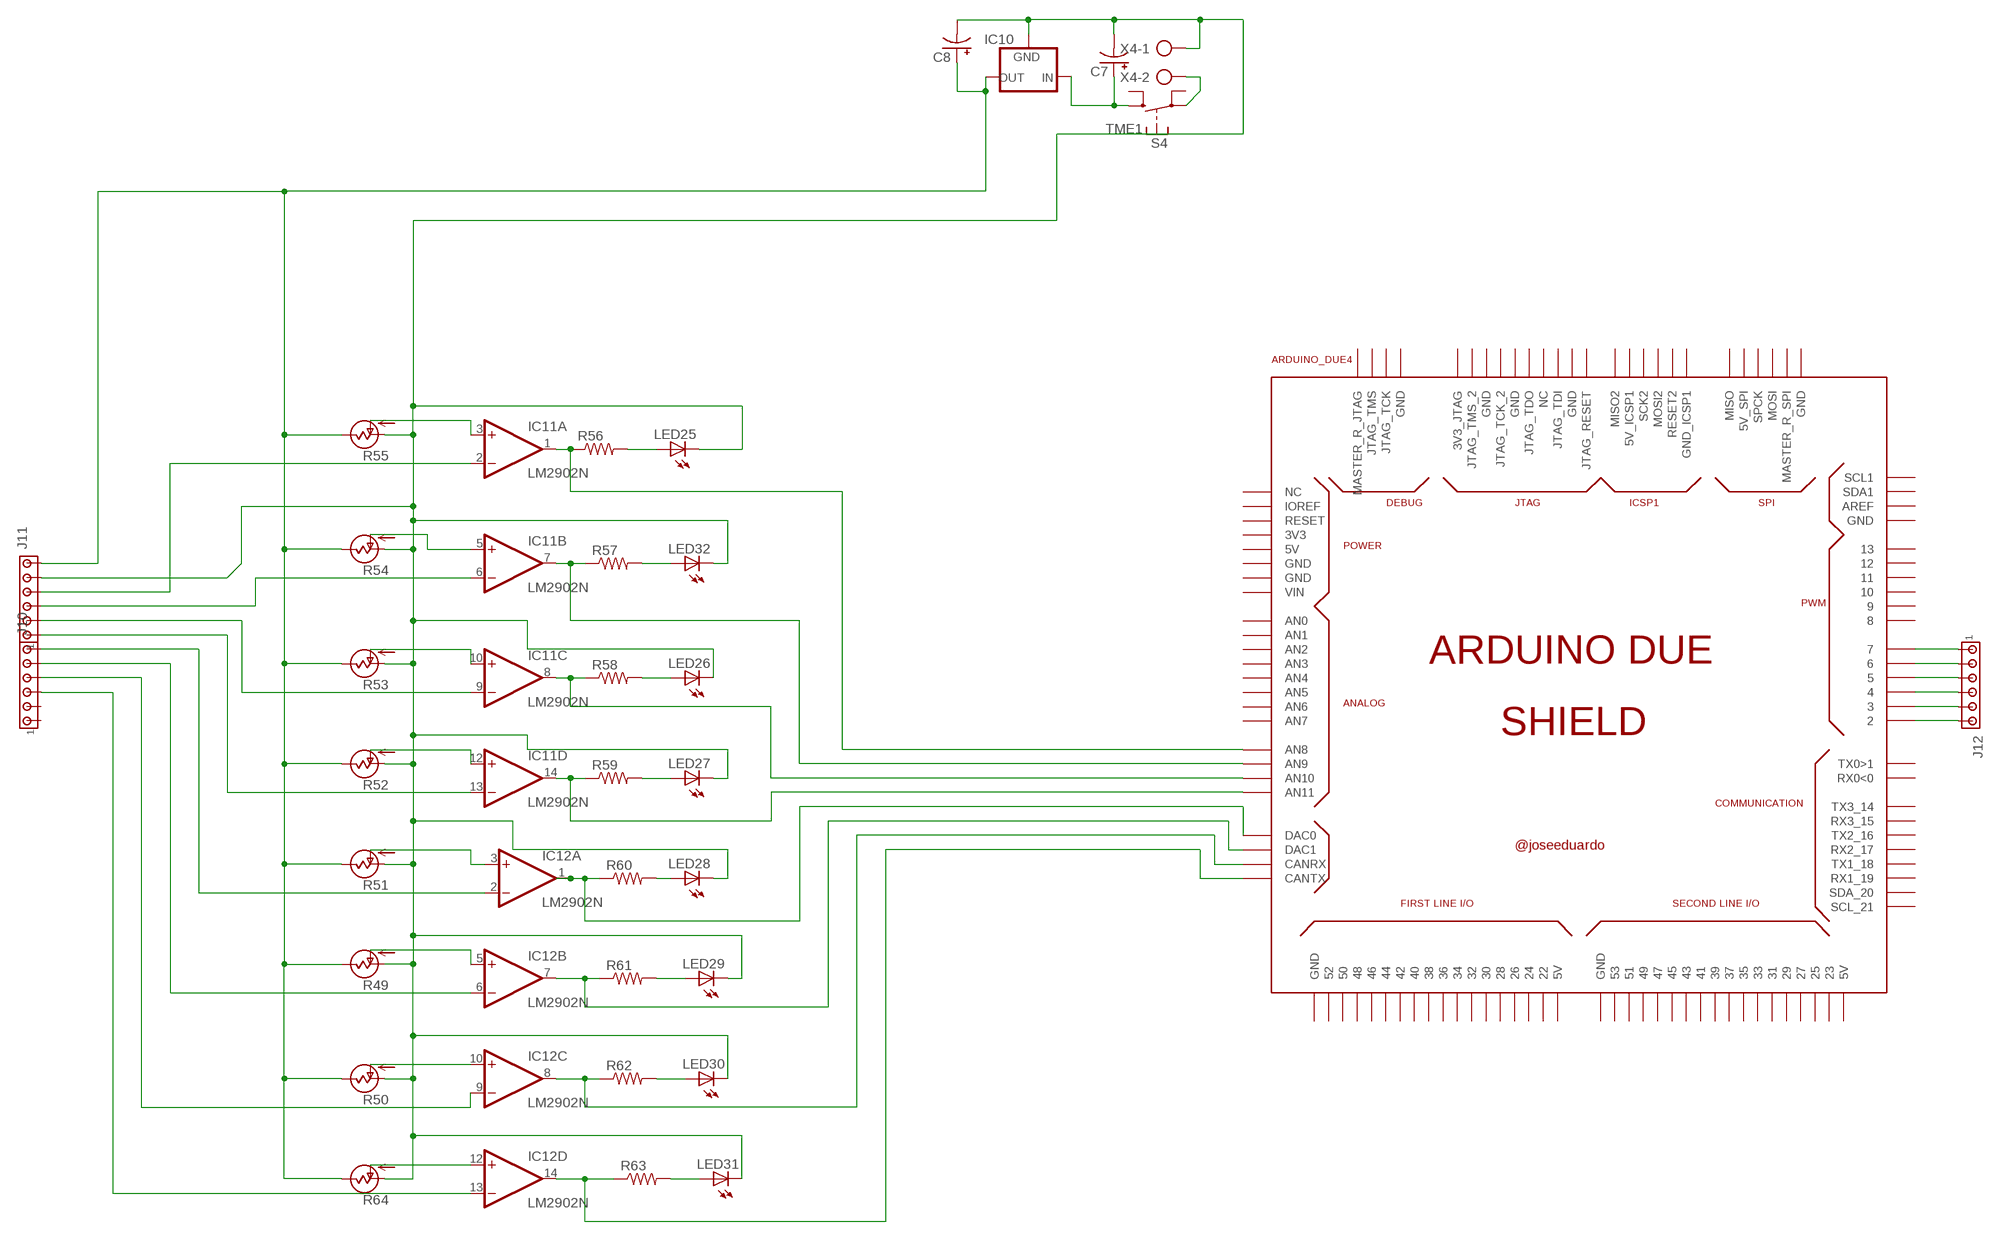
[diagram p3: schematic, sheet 4]

### Parts
ARDUINO_DUE4  ARDUINO_DUE_SHIELD  [ARDUINO_DUE_SHIELD]
C7  CPOL-USE5-10.5  [E5-10,5]
C8  CPOL-USE5-10.5  [E5-10,5]
IC10  V_REG_78XXSIDE  [78XXL]
IC11  LM2902N  [DIL14]
IC12  LM2902N  [DIL14]
J10  MTA06-156  [1X6MTA]
J11  MTA06-156  [1X6MTA]
J12  MTA06-156  [1X6MTA]
LED25  LED3MM  [LED3MM]
LED26  LED3MM  [LED3MM]
LED27  LED3MM  [LED3MM]
LED28  LED3MM  [LED3MM]
LED29  LED3MM  [LED3MM]
LED30  LED3MM  [LED3MM]
LED31  LED3MM  [LED3MM]
LED32  LED3MM  [LED3MM]
R49  POTTRS63P  [S63P]
R50  POTTRS63P  [S63P]
R51  POTTRS63P  [S63P]
R52  POTTRS63P  [S63P]
R53  POTTRS63P  [S63P]
R54  POTTRS63P  [S63P]
R55  POTTRS63P  [S63P]
R56  R-US_0207/10  [0207/10]
R57  R-US_0207/10  [0207/10]
R58  R-US_0207/10  [0207/10]
R59  R-US_0207/10  [0207/10]
R60  R-US_0207/10  [0207/10]
R61  R-US_0207/10  [0207/10]
R62  R-US_0207/10  [0207/10]
R63  R-US_0207/10  [0207/10]
R64  POTTRS63P  [S63P]
S4  TME1  [TME1]
X4  AK300/2  [AK300/2]

### Nets
N$181: IC11.5(B:+IN) R54.S(OUT)
N$182: IC11.3(A:+IN) R55.S(OUT)
N$183: IC11.10(C:+IN) R53.S(OUT)
N$184: IC11.12(D:+IN) R52.S(OUT)
N$185: IC12.3(A:+IN) R51.S(OUT)
N$186: IC12.5(B:+IN) R49.S(OUT)
N$187: IC12.10(C:+IN) R50.S(OUT)
N$188: IC12.12(D:+IN) R64.S(OUT)
N$189: ARDUINO_DUE4.A8(AN8) IC11.1(A:OUT) R56.1
N$190: ARDUINO_DUE4.A9(AN9) IC11.7(B:OUT) R57.1
N$191: ARDUINO_DUE4.A10(AN10) IC11.8(C:OUT) R58.1
N$192: LED26.A R58.2
N$193: ARDUINO_DUE4.A11(AN11) IC11.14(D:OUT) R59.1
N$194: ARDUINO_DUE4.DAC0 IC12.1(A:OUT) R60.1
N$195: ARDUINO_DUE4.DAC1 IC12.7(B:OUT) R61.1
N$196: ARDUINO_DUE4.CANRX IC12.8(C:OUT) R62.1
N$197: LED27.A R59.2
N$198: LED28.A R60.2
N$199: LED29.A R61.2
N$200: LED30.A R62.2
N$201: ARDUINO_DUE4.CANTX IC12.14(D:OUT) R63.1
N$202: LED31.A R63.2
N$203: LED25.A R56.2
N$204: LED32.A R57.2
N$205: IC11.2(A:-IN) J11.4
N$206: IC11.6(B:-IN) J11.3
N$207: IC11.9(C:-IN) J11.2
N$208: IC11.13(D:-IN) J11.1
N$209: IC12.2(A:-IN) J10.6
N$210: IC12.6(B:-IN) J10.5
N$211: IC12.9(C:-IN) J10.4
N$212: IC12.13(D:-IN) J10.3
N$213: C8.+ IC10.OUT J11.6 R49.E(VSS) R50.E(VSS) R51.E(VSS) R52.E(VSS) R53.E(VSS) R54.E(VSS) R55.E(VSS) R64.E(VSS)
N$214: C7.- C8.- IC10.GND J11.5 LED25.K(C) LED26.K(C) LED27.K(C) LED28.K(C) LED29.K(C) LED30.K(C) LED31.K(C) LED32.K(C) R49.A(VDD) R50.A(VDD) R51.A(VDD) R52.A(VDD) R53.A(VDD) R54.A(VDD) R55.A(VDD) R64.A(VDD) X4.1
N$215: C7.+ IC10.IN S4.1(S)
N$216: ARDUINO_DUE4.7 J12.1
N$217: ARDUINO_DUE4.6 J12.2
N$218: ARDUINO_DUE4.5 J12.3
N$219: ARDUINO_DUE4.4 J12.4
N$220: ARDUINO_DUE4.3 J12.5
N$221: ARDUINO_DUE4.2 J12.6
N$222: S4.2(P) X4.2
Unconnected: ARDUINO_DUE4.0(RX0<0) ARDUINO_DUE4.1(TX0>1) ARDUINO_DUE4.3V3 ARDUINO_DUE4.3V3_JTAG ARDUINO_DUE4.5V0(5V) ARDUINO_DUE4.5V0_1(5V) ARDUINO_DUE4.5V0_2(5V) ARDUINO_DUE4.5V_2(5V_SPI) ARDUINO_DUE4.5V_ICSP1 ARDUINO_DUE4.8 ARDUINO_DUE4.9 ARDUINO_DUE4.10 ARDUINO_DUE4.11 ARDUINO_DUE4.12 ARDUINO_DUE4.13 ARDUINO_DUE4.14(TX3_14) ARDUINO_DUE4.15(RX3_15) ARDUINO_DUE4.16(TX2_16) ARDUINO_DUE4.17(RX2_17) ARDUINO_DUE4.18(TX1_18) ARDUINO_DUE4.19(RX1_19) ARDUINO_DUE4.20(SDA_20) ARDUINO_DUE4.21(SCL_21) ARDUINO_DUE4.22 ARDUINO_DUE4.23 ARDUINO_DUE4.24 ARDUINO_DUE4.25 ARDUINO_DUE4.26 ARDUINO_DUE4.27 ARDUINO_DUE4.28 ARDUINO_DUE4.29 ARDUINO_DUE4.30 ARDUINO_DUE4.31 ARDUINO_DUE4.32 ARDUINO_DUE4.33 ARDUINO_DUE4.34 ARDUINO_DUE4.35 ARDUINO_DUE4.36 ARDUINO_DUE4.37 ARDUINO_DUE4.38 ARDUINO_DUE4.39 ARDUINO_DUE4.40 ARDUINO_DUE4.41 ARDUINO_DUE4.42 ARDUINO_DUE4.43 ARDUINO_DUE4.44 ARDUINO_DUE4.45 ARDUINO_DUE4.46 ARDUINO_DUE4.47 ARDUINO_DUE4.48 ARDUINO_DUE4.49 ARDUINO_DUE4.50 ARDUINO_DUE4.51 ARDUINO_DUE4.52 ARDUINO_DUE4.53 ARDUINO_DUE4.A0(AN0) ARDUINO_DUE4.A1(AN1) ARDUINO_DUE4.A2(AN2) ARDUINO_DUE4.A3(AN3) ARDUINO_DUE4.A4(AN4) ARDUINO_DUE4.A5(AN5) ARDUINO_DUE4.A6(AN6) ARDUINO_DUE4.A7(AN7) ARDUINO_DUE4.AREF ARDUINO_DUE4.GND ARDUINO_DUE4.GND_1(GND) ARDUINO_DUE4.GND_2(GND) ARDUINO_DUE4.GND_3(GND) ARDUINO_DUE4.GND_4(GND) ARDUINO_DUE4.GND_5(GND) ARDUINO_DUE4.GND_7(GND) ARDUINO_DUE4.GND_8(GND) ARDUINO_DUE4.GND_9(GND) ARDUINO_DUE4.GND_10(GND) ARDUINO_DUE4.GND_ICSP1 ARDUINO_DUE4.IOREF ARDUINO_DUE4.JTAG_RESET ARDUINO_DUE4.JTAG_TCK ARDUINO_DUE4.JTAG_TCK_2 ARDUINO_DUE4.JTAG_TDI ARDUINO_DUE4.JTAG_TDO ARDUINO_DUE4.JTAG_TMS ARDUINO_DUE4.JTAG_TMS_2 ARDUINO_DUE4.MASTER_RESET_JTAG(MASTER_R_JTAG) ARDUINO_DUE4.MASTER_RESET_SPI(MASTER_R_SPI) ARDUINO_DUE4.MISO ARDUINO_DUE4.MISO2 ARDUINO_DUE4.MOSI ARDUINO_DUE4.MOSI2 ARDUINO_DUE4.NC_2(NC) ARDUINO_DUE4.NC_5(NC) ARDUINO_DUE4.RESET ARDUINO_DUE4.RESET2 ARDUINO_DUE4.SCK2 ARDUINO_DUE4.SCL1 ARDUINO_DUE4.SDA1 ARDUINO_DUE4.SPCK ARDUINO_DUE4.VIN J10.1 J10.2 S4.4(P) S4.5(S)

## Power pins joined to a net without a drawn wire
V+: IC2.4(P:V+) IC3.4(P:V+)
V+1: IC4.4(P:V+) IC5.4(P:V+)
V+2: IC8.4(P:V+) IC9.4(P:V+)
V+3: IC11.4(P:V+) IC12.4(P:V+)
V-: IC2.11(P:V-) IC3.11(P:V-)
V-1: IC4.11(P:V-) IC5.11(P:V-)
V-2: IC8.11(P:V-) IC9.11(P:V-)
V-3: IC11.11(P:V-) IC12.11(P:V-)

## Library data of the parts
ARDUINO_DUE1-ARDUINO_DUE4 = arduino_due_shield:ARDUINO_DUE_SHIELD
C1-C8 = adafruit:CPOL-US: POLARIZED CAPACITOR, American symbol
IC1 IC6 IC7 IC10 = SparkFun:V_REG_78XX: Voltage Regulator Standard 7805 5V regulator. IGO (Input Ground Output). Spark Fun Electronics SKU : COM-00107
IC2-IC5 IC8 IC9 IC11 IC12 = linear:LM2902: COMPARATOR
J1-J12 = con-amp:MTA06-156: AMP connector
LED1-LED32 = adafruit:LED: LED OSRAM: - CHIPLED LG R971, LG N971, LY N971, LG Q971, LY Q971, LO R971, LY R971 LH N974, LH R974 LS Q976, LO Q976, LY Q976 LO Q996 - Hyper CHIPLED LW Q18S LB Q993, LB Q99A, LB R99A - SideLED LS A670, LO A670, LY A670, LG A670, LP A670 LB A673, LV A673, LT A673, LW A673 LH A674 LY A675 LS A676, LA A676, LO A676, LY A676, LW A676 LS A679, LY A679, LG A679 - Hyper Micro SIDELED® LS Y876, LA Y876, LO Y876, LY Y876 LT Y87S - SmartLED LW L88C, LW L88S LB L89C, LB L89S, LG L890 LS L89K, LO L89K, LY L89K LS L896, LA L896, LO L896, LY L896 - TOPLED LS T670, LO T670, LY T670, LG T670, LP T670 LSG T670, LSP T670, LSY T670, LOP T670, LYG T670 LG T671, LOG T671, LSG T671 LB T673, LV T673, LT T673, LW T673 LH T674 LS T676, LA T676, LO T676, LY T676, LB T676, LH T676, LSB T676, LW T676 LB T67C, LV T67C, LT T67C, LS T67K, LO T67K, LY T67K, LW E67C LS E67B, LA E67B, LO E67B, LY E67B, LB E67C, LV E67C, LT E67C LW T67C LS T679, LY T679, LG T679 LS T770, LO T770, LY T770, LG T770, LP T770 LB T773, LV T773, LT T773, LW T773 LH T774 LS E675, LA E675, LY E675, LS T675 LS T776, LA T776, LO T776, LY T776, LB T776 LHGB T686 LT T68C, LB T68C - Hyper Mini TOPLED® LB M676 - Mini TOPLED Santana® LG M470 LS M47K, LO M47K, LY M47K Source: http://www.osram.convergy.de/
R1-R7 R16-R23 R32-R39 R48-R55 R64 = tango:POTTR: POTENTIOMETER
R8-R15 R24-R31 R40-R47 R56-R63 = adafruit:R-US_: RESISTOR, American symbol
S1-S4 = switch-misc:TME1: SWITCH
X1-X4 = con-ptr500:AK300/2: CONNECTOR